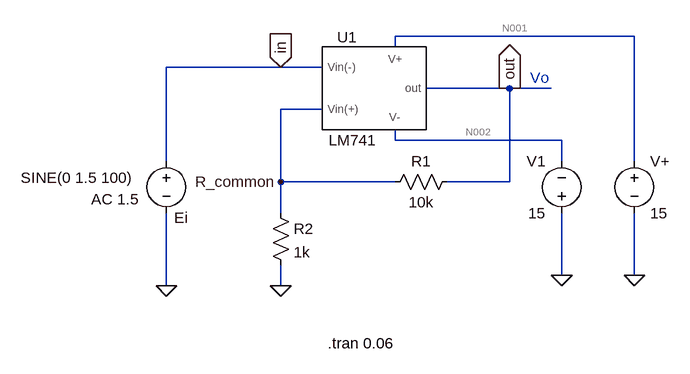
[diagram p0: schematic Schema_4-7.asc]
Schema_4-7.asc, the LTspice schematic file:
Version 4.1
SHEET 1 880 680
WIRE 480 -112 112 -112
WIRE 112 -96 112 -112
WIRE -64 -64 -240 -64
WIRE 0 -64 -64 -64
WIRE 288 -32 160 -32
WIRE 352 -32 288 -32
WIRE 0 0 -64 0
WIRE 112 48 112 32
WIRE 368 48 112 48
WIRE -240 80 -240 -64
WIRE 368 80 368 48
WIRE 480 80 480 -112
WIRE -64 112 -64 0
WIRE 112 112 -64 112
WIRE 288 112 288 -32
WIRE 288 112 192 112
WIRE -64 160 -64 112
WIRE 368 256 368 160
WIRE 480 256 480 160
WIRE -240 272 -240 160
WIRE -64 272 -64 240
FLAG -240 272 0
FLAG -64 272 0
FLAG 368 256 0
FLAG 480 256 0
FLAG 288 -32 out
IOPIN 288 -32 Out
FLAG -64 -64 in
IOPIN -64 -64 In
FLAG -64 112 R_common
SYMBOL res -80 144 R0
SYMATTR InstName R2
SYMATTR Value 1k
SYMBOL res 208 96 R90
WINDOW 0 0 56 VBottom 2
WINDOW 3 32 56 VTop 2
SYMATTR InstName R1
SYMATTR Value 10k
SYMBOL voltage -240 64 R0
WINDOW 0 12 103 Left 2
WINDOW 3 -224 42 Left 2
WINDOW 123 -116 75 Left 2
WINDOW 39 0 0 Left 0
SYMATTR InstName Ei
SYMATTR Value SINE(0 1.5 100)
SYMATTR Value2 AC 1.5
SYMBOL voltage 480 64 R0
SYMATTR InstName V+
SYMATTR Value 15
SYMBOL voltage 368 176 R180
WINDOW 0 24 96 Left 2
WINDOW 3 24 16 Left 2
SYMATTR InstName V1
SYMATTR Value 15
SYMBOL LM741 48 -48 R0
SYMATTR InstName U1
TEXT 320 -48 Left 2 ;Vo
TEXT 8 360 Left 2 !.tran 0.06

The netlist it stands for:
* Schema_4-7.asc
R2 R_common 0 1k
R1 out R_common 10k
V§Ei in 0 SINE(0 1.5 100) AC 1.5
V+ N001 0 15
V1 0 N002 15
X§U1 R_common in N001 N002 out LM741  ; pins Vin(+) Vin(-) V+ V- out
* Vo
.tran 0.06
.lib C:\users\kou\Documents\Electronics\Electronics_2\LM741\lm741.lib
.backanno
.end

* Results of the author's LTspice run, read from the files saved beside the schematic
* Operating Point, zero values left out:
*   V(out) = -10.42 mV
*   V(n001) = 15 V
*   V(n002) = -15 V
*   V(r_common) = -1 mV
*   I(R2) = -1 µA
*   I(Ei) = -101.9 nA
*   I(V1) = -1.702 mA
*   I(V+) = -1.701 mA
*   I(R1) = -942.2 nA
*   Ix(u1:1) = 57.86 nA
*   Ix(u1:2) = 101.9 nA
*   Ix(u1:99) = 1.701 mA
*   Ix(u1:50) = -1.702 mA
*   Ix(u1:28) = 942.2 nA
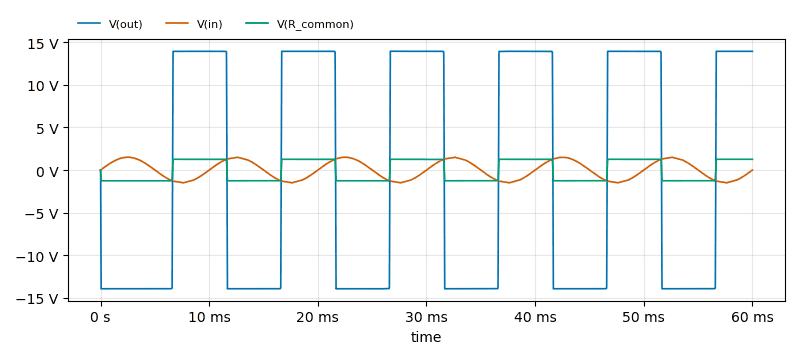
[diagram p1: Transient Analysis of Schema_4-7.asc, plotted from the saved traces]
* Transient Analysis, 1 run:
*   V(out): min -13.94 V, max 13.93 V, average -741.2 mV, rms 13.85 V, last 13.92 V
*   V(in): min -1.495 V, max 1.5 V, average 3.775 mV, rms 1.046 V, last 0 V
*   V(R_common): min -1.266 V, max 1.266 V, average -67.3 mV, rms 1.256 V, last 1.263 V